# EAGLE schematic Control_Board (EAGLE 7.5.0)
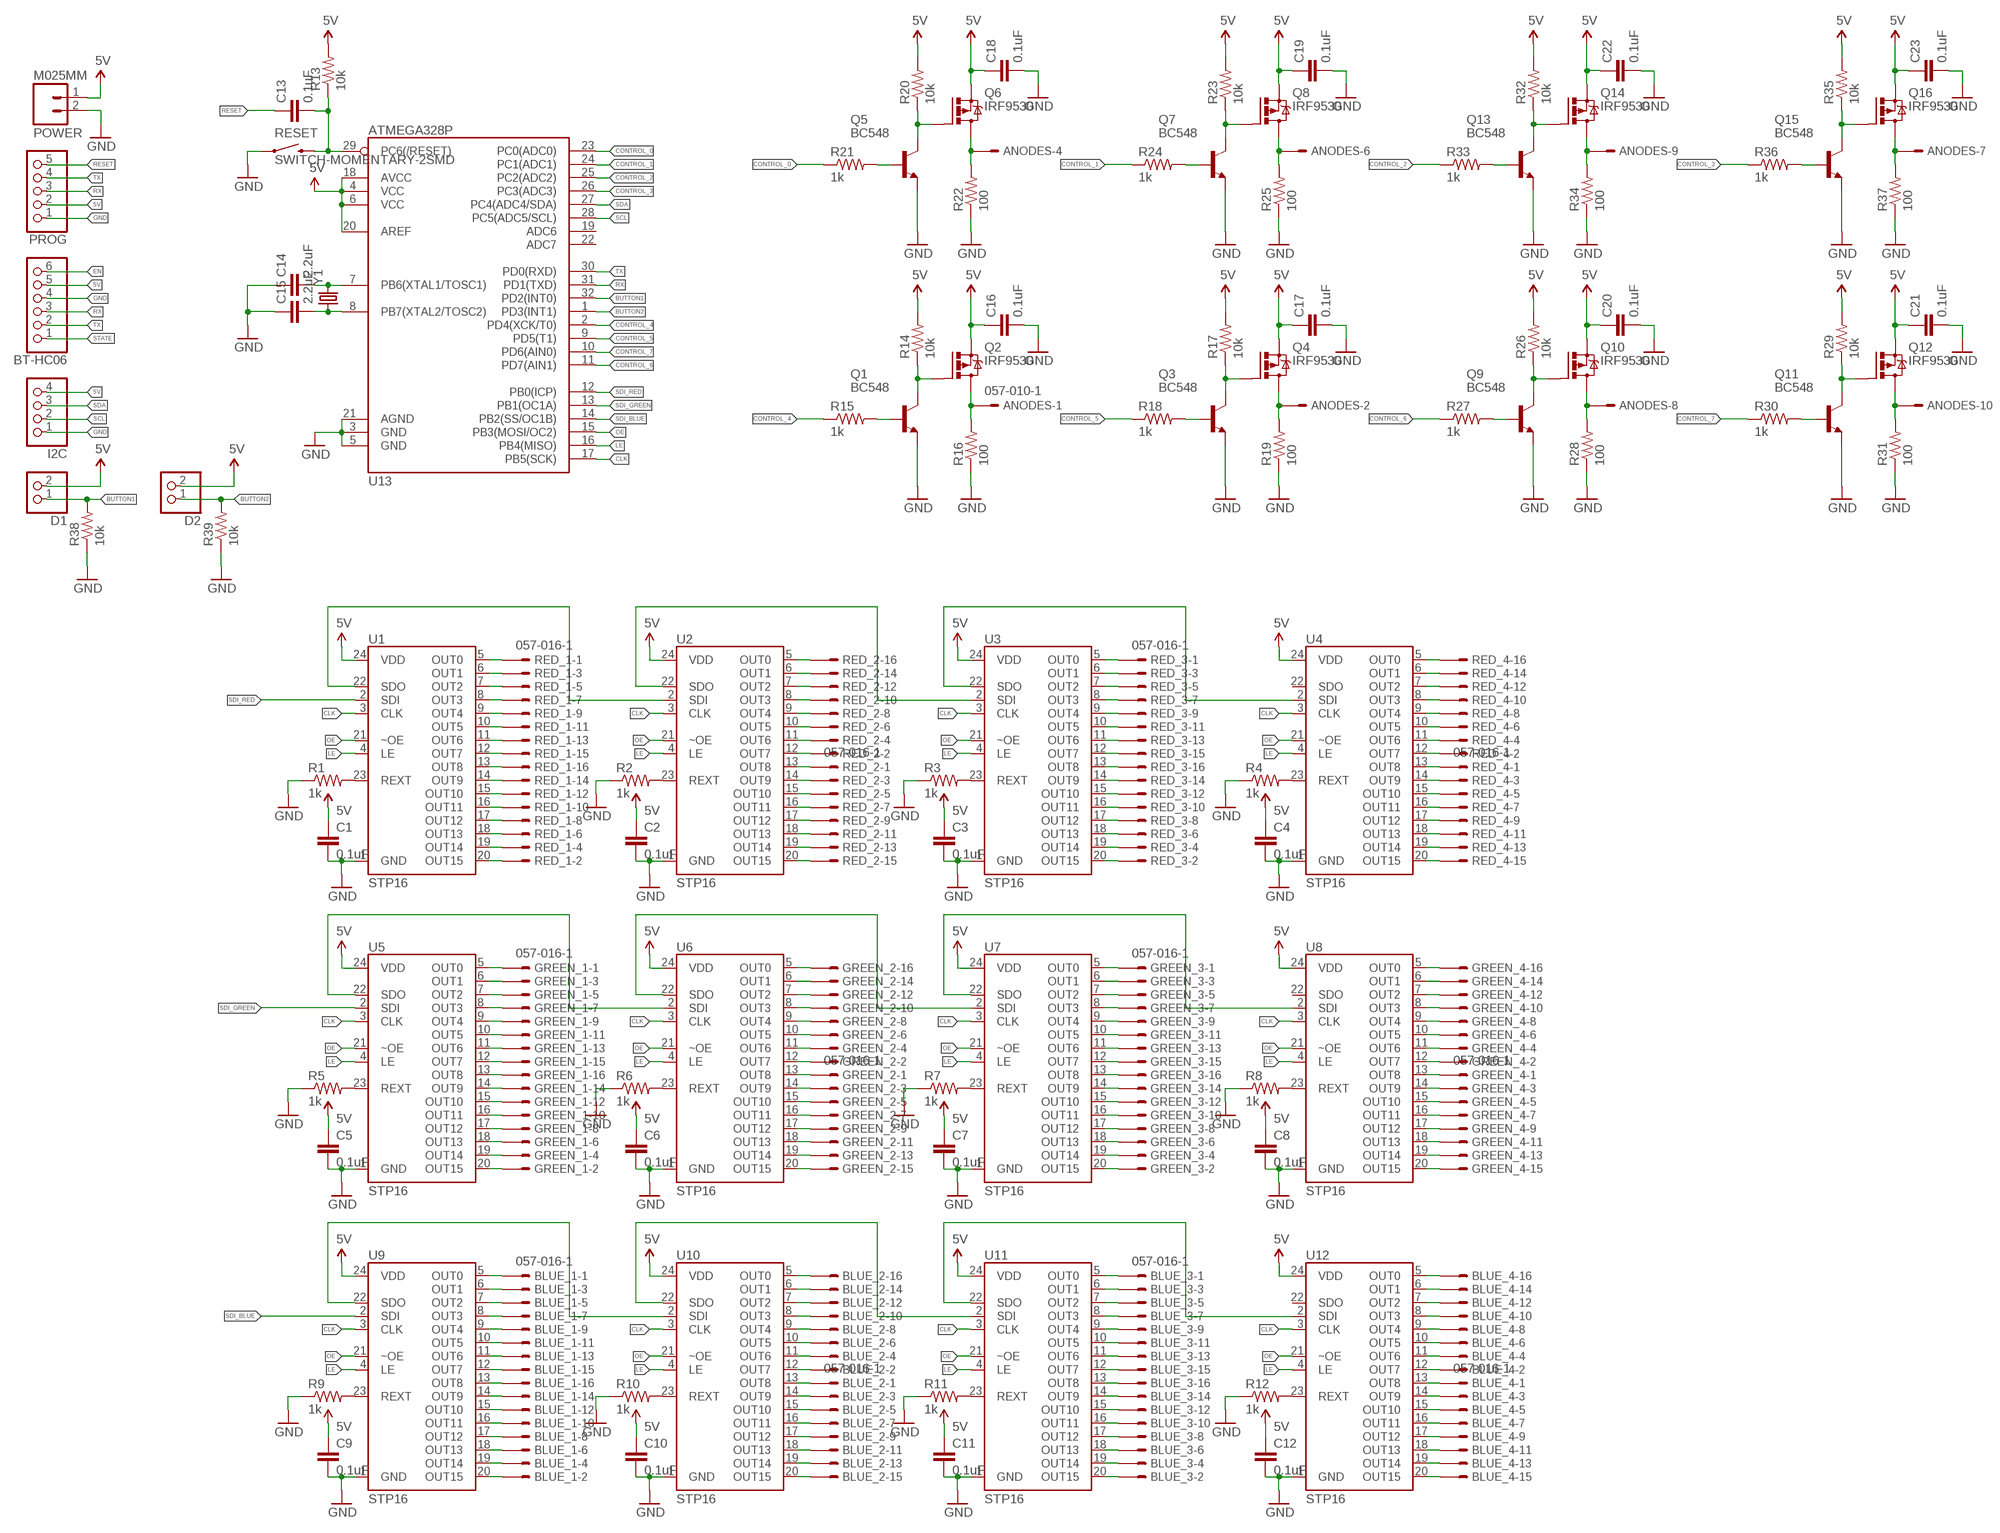
[diagram p0: schematic, sheet 1]

## Parts
ANODES  057-010-1  [057-010-1]
BLUE_1  057-016-1  [057-016-1]
BLUE_2  057-016-1  [057-016-1]
BLUE_3  057-016-1  [057-016-1]
BLUE_4  057-016-1  [057-016-1]
BT-HC06  PINHD-1X6/90  [1X06/90]
C1  0.1uF  0.1UF-100V-10%(0603)  [0603-CAP]
C2  0.1uF  0.1UF-100V-10%(0603)  [0603-CAP]
C3  0.1uF  0.1UF-100V-10%(0603)  [0603-CAP]
C4  0.1uF  0.1UF-100V-10%(0603)  [0603-CAP]
C5  0.1uF  0.1UF-100V-10%(0603)  [0603-CAP]
C6  0.1uF  0.1UF-100V-10%(0603)  [0603-CAP]
C7  0.1uF  0.1UF-100V-10%(0603)  [0603-CAP]
C8  0.1uF  0.1UF-100V-10%(0603)  [0603-CAP]
C9  0.1uF  0.1UF-100V-10%(0603)  [0603-CAP]
C10  0.1uF  0.1UF-100V-10%(0603)  [0603-CAP]
C11  0.1uF  0.1UF-100V-10%(0603)  [0603-CAP]
C12  0.1uF  0.1UF-100V-10%(0603)  [0603-CAP]
C13  0.1uF  0.1UF-100V-10%(0603)  [0603-CAP]
C14  2.2uF  2.2UF-10V-20%(0603)  [0603-CAP]
C15  2.2uF  2.2UF-10V-20%(0603)  [0603-CAP]
C16  0.1uF  0.1UF-100V-10%(0603)  [0603-CAP]
C17  0.1uF  0.1UF-100V-10%(0603)  [0603-CAP]
C18  0.1uF  0.1UF-100V-10%(0603)  [0603-CAP]
C19  0.1uF  0.1UF-100V-10%(0603)  [0603-CAP]
C20  0.1uF  0.1UF-100V-10%(0603)  [0603-CAP]
C21  0.1uF  0.1UF-100V-10%(0603)  [0603-CAP]
C22  0.1uF  0.1UF-100V-10%(0603)  [0603-CAP]
C23  0.1uF  0.1UF-100V-10%(0603)  [0603-CAP]
D1  PINHD-1X2/90  [1X02/90]
D2  PINHD-1X2/90  [1X02/90]
GREEN_1  057-016-1  [057-016-1]
GREEN_2  057-016-1  [057-016-1]
GREEN_3  057-016-1  [057-016-1]
GREEN_4  057-016-1  [057-016-1]
I2C  PINHD-1X4/90  [1X04/90]
POWER  M025MM  [SCREWTERMINAL-5MM-2]
PROG  PINHD-1X5/90  [1X05/90]
Q1  BC548  [TO92-EBC]
Q2  IRF9530  [TO220BV]
Q3  BC548  [TO92-EBC]
Q4  IRF9530  [TO220BV]
Q5  BC548  [TO92-EBC]
Q6  IRF9530  [TO220BV]
Q7  BC548  [TO92-EBC]
Q8  IRF9530  [TO220BV]
Q9  BC548  [TO92-EBC]
Q10  IRF9530  [TO220BV]
Q11  BC548  [TO92-EBC]
Q12  IRF9530  [TO220BV]
Q13  BC548  [TO92-EBC]
Q14  IRF9530  [TO220BV]
Q15  BC548  [TO92-EBC]
Q16  IRF9530  [TO220BV]
R1  1k  1K-1%  [0603-RES]
R2  1k  1K-1%  [0603-RES]
R3  1k  1K-1%  [0603-RES]
R4  1k  1K-1%  [0603-RES]
R5  1k  1K-1%  [0603-RES]
R6  1k  1K-1%  [0603-RES]
R7  1k  1K-1%  [0603-RES]
R8  1k  1K-1%  [0603-RES]
R9  1k  1K-1%  [0603-RES]
R10  1k  1K-1%  [0603-RES]
R11  1k  1K-1%  [0603-RES]
R12  1k  1K-1%  [0603-RES]
R13  10k  10K-1%RES-00824  [0603-RES]
R14  10k  10K-1%RES-00824  [0603-RES]
R15  1k  1K-1%  [0603-RES]
R16  100  100OHM1/10W1%(0603)  [0603-RES]
R17  10k  10K-1%RES-00824  [0603-RES]
R18  1k  1K-1%  [0603-RES]
R19  100  100OHM1/10W1%(0603)  [0603-RES]
R20  10k  10K-1%RES-00824  [0603-RES]
R21  1k  1K-1%  [0603-RES]
R22  100  100OHM1/10W1%(0603)  [0603-RES]
R23  10k  10K-1%RES-00824  [0603-RES]
R24  1k  1K-1%  [0603-RES]
R25  100  100OHM1/10W1%(0603)  [0603-RES]
R26  10k  10K-1%RES-00824  [0603-RES]
R27  1k  1K-1%  [0603-RES]
R28  100  100OHM1/10W1%(0603)  [0603-RES]
R29  10k  10K-1%RES-00824  [0603-RES]
R30  1k  1K-1%  [0603-RES]
R31  100  100OHM1/10W1%(0603)  [0603-RES]
R32  10k  10K-1%RES-00824  [0603-RES]
R33  1k  1K-1%  [0603-RES]
R34  100  100OHM1/10W1%(0603)  [0603-RES]
R35  10k  10K-1%RES-00824  [0603-RES]
R36  1k  1K-1%  [0603-RES]
R37  100  100OHM1/10W1%(0603)  [0603-RES]
R38  10k  10K-1%RES-00824  [0603-RES]
R39  10k  10K-1%RES-00824  [0603-RES]
RED_1  057-016-1  [057-016-1]
RED_2  057-016-1  [057-016-1]
RED_3  057-016-1  [057-016-1]
RED_4  057-016-1  [057-016-1]
RESET  SWITCH-MOMENTARY-2SMD  [TACTILE_SWITCH_SMD]
U1  STP16  [TSSOP-24]
U2  STP16  [TSSOP-24]
U3  STP16  [TSSOP-24]
U4  STP16  [TSSOP-24]
U5  STP16  [TSSOP-24]
U6  STP16  [TSSOP-24]
U7  STP16  [TSSOP-24]
U8  STP16  [TSSOP-24]
U9  STP16  [TSSOP-24]
U10  STP16  [TSSOP-24]
U11  STP16  [TSSOP-24]
U12  STP16  [TSSOP-24]
U13  ATMEGA328P  ATMEGA328_SMT  [TQFP32-08]
Y1  CRYSTALHC49UV  [HC49U-V]

## Nets
5V: BT-HC06.5 C1.1 C2.1 C3.1 C4.1 C5.1 C6.1 C7.1 C8.1 C9.1 C10.1 C11.1 C12.1 C16.1 C17.1 C18.1 C19.1 C20.1 C21.1 C22.1 C23.1 D1.2 D2.2 I2C.4 POWER.1 PROG.2 Q2.S Q4.S Q6.S Q8.S Q10.S Q12.S Q14.S Q16.S R13.2 R14.2 R17.2 R20.2 R23.2 R26.2 R29.2 R32.2 R35.2 U1.24(VDD) U2.24(VDD) U3.24(VDD) U4.24(VDD) U5.24(VDD) U6.24(VDD) U7.24(VDD) U8.24(VDD) U9.24(VDD) U10.24(VDD) U11.24(VDD) U12.24(VDD) U13.6(VCC) U13.18(AVCC) U13.20(AREF)
BUTTON1: D1.1 R38.2 U13.32(PD2(INT0))
BUTTON2: D2.1 R39.2 U13.1(PD3(INT1))
CLK: U1.3(CLK) U2.3(CLK) U3.3(CLK) U4.3(CLK) U5.3(CLK) U6.3(CLK) U7.3(CLK) U8.3(CLK) U9.3(CLK) U10.3(CLK) U11.3(CLK) U12.3(CLK) U13.17(PB5(SCK))
CONTROL_0: R21.1 U13.23(PC0(ADC0))
CONTROL_1: R24.1 U13.24(PC1(ADC1))
CONTROL_2: R33.1 U13.25(PC2(ADC2))
CONTROL_3: R36.1 U13.26(PC3(ADC3))
CONTROL_4: R15.1 U13.2(PD4(XCK/T0))
CONTROL_5: R18.1 U13.9(PD5(T1))
CONTROL_6: R27.1 U13.11(PD7(AIN1))
CONTROL_7: R30.1 U13.10(PD6(AIN0))
EN: BT-HC06.6
GND: BT-HC06.4 C1.2 C2.2 C3.2 C4.2 C5.2 C6.2 C7.2 C8.2 C9.2 C10.2 C11.2 C12.2 C14.1 C15.1 C16.2 C17.2 C18.2 C19.2 C20.2 C21.2 C22.2 C23.2 I2C.1 POWER.2 PROG.1 Q1.E Q3.E Q5.E Q7.E Q9.E Q11.E Q13.E Q15.E R1.1 R2.1 R3.1 R4.1 R5.1 R6.1 R7.1 R8.1 R9.1 R10.1 R11.1 R12.1 R16.1 R19.1 R22.1 R25.1 R28.1 R31.1 R34.1 R37.1 R38.1 R39.1 RESET.1 U1.1(GND) U2.1(GND) U3.1(GND) U4.1(GND) U5.1(GND) U6.1(GND) U7.1(GND) U8.1(GND) U9.1(GND) U10.1(GND) U11.1(GND) U12.1(GND) U13.5(GND) U13.21(AGND)
LE: U1.4(LE) U2.4(LE) U3.4(LE) U4.4(LE) U5.4(LE) U6.4(LE) U7.4(LE) U8.4(LE) U9.4(LE) U10.4(LE) U11.4(LE) U12.4(LE) U13.16(PB4(MISO))
LEVEL_0: ANODES.4 Q6.D R22.2
LEVEL_1: ANODES.6 Q8.D R25.2
LEVEL_2: ANODES.9 Q14.D R34.2
LEVEL_3: ANODES.7 Q16.D R37.2
LEVEL_4: ANODES.1 Q2.D R16.2
LEVEL_5: ANODES.2 Q4.D R19.2
LEVEL_6: ANODES.8 Q10.D R28.2
LEVEL_7: ANODES.10 Q12.D R31.2
N$1: R1.2 U1.23(REXT)
N$2: RED_1.16 U1.13(OUT8)
N$3: RED_1.14 U1.14(OUT9)
N$4: RED_1.12 U1.15(OUT10)
N$5: RED_1.10 U1.16(OUT11)
N$6: RED_1.8 U1.17(OUT12)
N$7: RED_1.6 U1.18(OUT13)
N$8: RED_1.4 U1.19(OUT14)
N$9: RED_1.2 U1.20(OUT15)
N$10: RED_1.15 U1.12(OUT7)
N$11: RED_1.13 U1.11(OUT6)
N$12: RED_1.11 U1.10(OUT5)
N$13: RED_1.9 U1.9(OUT4)
N$14: RED_1.7 U1.8(OUT3)
N$15: RED_1.5 U1.7(OUT2)
N$16: RED_1.3 U1.6(OUT1)
N$17: RED_1.1 U1.5(OUT0)
N$18: R2.2 U2.23(REXT)
N$19: RED_2.2 U2.12(OUT7)
N$20: RED_2.4 U2.11(OUT6)
N$21: RED_2.6 U2.10(OUT5)
N$22: RED_2.8 U2.9(OUT4)
N$23: RED_2.10 U2.8(OUT3)
N$24: RED_2.12 U2.7(OUT2)
N$25: RED_2.14 U2.6(OUT1)
N$26: RED_2.16 U2.5(OUT0)
N$27: RED_2.1 U2.13(OUT8)
N$28: RED_2.3 U2.14(OUT9)
N$29: RED_2.5 U2.15(OUT10)
N$30: RED_2.7 U2.16(OUT11)
N$31: RED_2.9 U2.17(OUT12)
N$32: RED_2.11 U2.18(OUT13)
N$33: RED_2.13 U2.19(OUT14)
N$34: RED_2.15 U2.20(OUT15)
N$35: R3.2 U3.23(REXT)
N$36: RED_3.1 U3.5(OUT0)
N$37: RED_3.2 U3.20(OUT15)
N$38: RED_3.3 U3.6(OUT1)
N$39: RED_3.4 U3.19(OUT14)
N$40: RED_3.5 U3.7(OUT2)
N$41: RED_3.6 U3.18(OUT13)
N$42: RED_3.7 U3.8(OUT3)
N$43: RED_3.8 U3.17(OUT12)
N$44: RED_3.9 U3.9(OUT4)
N$45: RED_3.10 U3.16(OUT11)
N$46: RED_3.11 U3.10(OUT5)
N$47: RED_3.12 U3.15(OUT10)
N$48: RED_3.13 U3.11(OUT6)
N$49: RED_3.14 U3.14(OUT9)
N$50: RED_3.15 U3.12(OUT7)
N$51: RED_3.16 U3.13(OUT8)
N$52: R4.2 U4.23(REXT)
N$53: RED_4.1 U4.13(OUT8)
N$54: RED_4.2 U4.12(OUT7)
N$55: RED_4.3 U4.14(OUT9)
N$56: RED_4.4 U4.11(OUT6)
N$57: RED_4.5 U4.15(OUT10)
N$58: RED_4.6 U4.10(OUT5)
N$59: RED_4.7 U4.16(OUT11)
N$60: RED_4.8 U4.9(OUT4)
N$61: RED_4.9 U4.17(OUT12)
N$62: RED_4.10 U4.8(OUT3)
N$63: RED_4.11 U4.18(OUT13)
N$64: RED_4.12 U4.7(OUT2)
N$65: RED_4.13 U4.19(OUT14)
N$66: RED_4.14 U4.6(OUT1)
N$67: RED_4.15 U4.20(OUT15)
N$68: RED_4.16 U4.5(OUT0)
N$69: U1.22(SDO) U2.2(SDI)
N$70: U2.22(SDO) U3.2(SDI)
N$71: U3.22(SDO) U4.2(SDI)
N$72: R5.2 U5.23(REXT)
N$73: R6.2 U6.23(REXT)
N$74: R7.2 U7.23(REXT)
N$75: R8.2 U8.23(REXT)
N$76: U5.22(SDO) U6.2(SDI)
N$77: U6.22(SDO) U7.2(SDI)
N$78: U7.22(SDO) U8.2(SDI)
N$79: GREEN_1.16 U5.13(OUT8)
N$80: GREEN_1.14 U5.14(OUT9)
N$81: GREEN_1.12 U5.15(OUT10)
N$82: GREEN_1.10 U5.16(OUT11)
N$83: GREEN_1.8 U5.17(OUT12)
N$84: GREEN_1.6 U5.18(OUT13)
N$85: GREEN_1.4 U5.19(OUT14)
N$86: GREEN_1.2 U5.20(OUT15)
N$87: GREEN_1.15 U5.12(OUT7)
N$88: GREEN_1.13 U5.11(OUT6)
N$89: GREEN_1.11 U5.10(OUT5)
N$90: GREEN_1.9 U5.9(OUT4)
N$91: GREEN_1.7 U5.8(OUT3)
N$92: GREEN_1.5 U5.7(OUT2)
N$93: GREEN_1.3 U5.6(OUT1)
N$94: GREEN_1.1 U5.5(OUT0)
N$95: GREEN_3.1 U7.5(OUT0)
N$96: GREEN_3.2 U7.20(OUT15)
N$97: GREEN_3.3 U7.6(OUT1)
N$98: GREEN_3.4 U7.19(OUT14)
N$99: GREEN_3.5 U7.7(OUT2)
N$100: GREEN_3.6 U7.18(OUT13)
N$101: GREEN_3.7 U7.8(OUT3)
N$102: GREEN_3.8 U7.17(OUT12)
N$103: GREEN_3.9 U7.9(OUT4)
N$104: GREEN_3.10 U7.16(OUT11)
N$105: GREEN_3.11 U7.10(OUT5)
N$106: GREEN_3.12 U7.15(OUT10)
N$107: GREEN_3.13 U7.11(OUT6)
N$108: GREEN_3.14 U7.14(OUT9)
N$109: GREEN_3.15 U7.12(OUT7)
N$110: GREEN_3.16 U7.13(OUT8)
N$111: GREEN_2.2 U6.12(OUT7)
N$112: GREEN_2.4 U6.11(OUT6)
N$113: GREEN_2.6 U6.10(OUT5)
N$114: GREEN_2.8 U6.9(OUT4)
N$115: GREEN_2.10 U6.8(OUT3)
N$116: GREEN_2.12 U6.7(OUT2)
N$117: GREEN_2.14 U6.6(OUT1)
N$118: GREEN_2.16 U6.5(OUT0)
N$119: GREEN_2.1 U6.13(OUT8)
N$120: GREEN_2.3 U6.14(OUT9)
N$121: GREEN_2.5 U6.15(OUT10)
N$122: GREEN_2.7 U6.16(OUT11)
N$123: GREEN_2.9 U6.17(OUT12)
N$124: GREEN_2.11 U6.18(OUT13)
N$125: GREEN_2.13 U6.19(OUT14)
N$126: GREEN_2.15 U6.20(OUT15)
N$127: GREEN_4.1 U8.13(OUT8)
N$128: GREEN_4.2 U8.12(OUT7)
N$129: GREEN_4.3 U8.14(OUT9)
N$130: GREEN_4.4 U8.11(OUT6)
N$131: GREEN_4.5 U8.15(OUT10)
N$132: GREEN_4.6 U8.10(OUT5)
N$133: GREEN_4.7 U8.16(OUT11)
N$134: GREEN_4.8 U8.9(OUT4)
N$135: GREEN_4.9 U8.17(OUT12)
N$136: GREEN_4.10 U8.8(OUT3)
N$137: GREEN_4.11 U8.18(OUT13)
N$138: GREEN_4.12 U8.7(OUT2)
N$139: GREEN_4.13 U8.19(OUT14)
N$140: GREEN_4.14 U8.6(OUT1)
N$141: GREEN_4.15 U8.20(OUT15)
N$142: GREEN_4.16 U8.5(OUT0)
N$143: R9.2 U9.23(REXT)
N$144: R10.2 U10.23(REXT)
N$145: R11.2 U11.23(REXT)
N$146: R12.2 U12.23(REXT)
N$147: U9.22(SDO) U10.2(SDI)
N$148: U10.22(SDO) U11.2(SDI)
N$149: U11.22(SDO) U12.2(SDI)
N$150: BLUE_1.16 U9.13(OUT8)
N$151: BLUE_1.14 U9.14(OUT9)
N$152: BLUE_1.12 U9.15(OUT10)
N$153: BLUE_1.10 U9.16(OUT11)
N$154: BLUE_1.8 U9.17(OUT12)
N$155: BLUE_1.6 U9.18(OUT13)
N$156: BLUE_1.4 U9.19(OUT14)
N$157: BLUE_1.2 U9.20(OUT15)
N$158: BLUE_1.15 U9.12(OUT7)
N$159: BLUE_1.13 U9.11(OUT6)
N$160: BLUE_1.11 U9.10(OUT5)
N$161: BLUE_1.9 U9.9(OUT4)
N$162: BLUE_1.7 U9.8(OUT3)
N$163: BLUE_1.5 U9.7(OUT2)
N$164: BLUE_1.3 U9.6(OUT1)
N$165: BLUE_1.1 U9.5(OUT0)
N$166: BLUE_3.1 U11.5(OUT0)
N$167: BLUE_3.2 U11.20(OUT15)
N$168: BLUE_3.3 U11.6(OUT1)
N$169: BLUE_3.4 U11.19(OUT14)
N$170: BLUE_3.5 U11.7(OUT2)
N$171: BLUE_3.6 U11.18(OUT13)
N$172: BLUE_3.7 U11.8(OUT3)
N$173: BLUE_3.8 U11.17(OUT12)
N$174: BLUE_3.9 U11.9(OUT4)
N$175: BLUE_3.10 U11.16(OUT11)
N$176: BLUE_3.11 U11.10(OUT5)
N$177: BLUE_3.12 U11.15(OUT10)
N$178: BLUE_3.13 U11.11(OUT6)
N$179: BLUE_3.14 U11.14(OUT9)
N$180: BLUE_3.15 U11.12(OUT7)
N$181: BLUE_3.16 U11.13(OUT8)
N$182: BLUE_2.2 U10.12(OUT7)
N$183: BLUE_2.4 U10.11(OUT6)
N$184: BLUE_2.6 U10.10(OUT5)
N$185: BLUE_2.8 U10.9(OUT4)
N$186: BLUE_2.10 U10.8(OUT3)
N$187: BLUE_2.12 U10.7(OUT2)
N$188: BLUE_2.14 U10.6(OUT1)
N$189: BLUE_2.16 U10.5(OUT0)
N$190: BLUE_2.1 U10.13(OUT8)
N$191: BLUE_2.3 U10.14(OUT9)
N$192: BLUE_2.5 U10.15(OUT10)
N$193: BLUE_2.7 U10.16(OUT11)
N$194: BLUE_2.9 U10.17(OUT12)
N$195: BLUE_2.11 U10.18(OUT13)
N$196: BLUE_2.13 U10.19(OUT14)
N$197: BLUE_2.15 U10.20(OUT15)
N$198: BLUE_4.1 U12.13(OUT8)
N$199: BLUE_4.2 U12.12(OUT7)
N$200: BLUE_4.3 U12.14(OUT9)
N$201: BLUE_4.4 U12.11(OUT6)
N$202: BLUE_4.5 U12.15(OUT10)
N$203: BLUE_4.6 U12.10(OUT5)
N$204: BLUE_4.7 U12.16(OUT11)
N$205: BLUE_4.8 U12.9(OUT4)
N$206: BLUE_4.9 U12.17(OUT12)
N$207: BLUE_4.10 U12.8(OUT3)
N$208: BLUE_4.11 U12.18(OUT13)
N$209: BLUE_4.12 U12.7(OUT2)
N$210: BLUE_4.13 U12.19(OUT14)
N$211: BLUE_4.14 U12.6(OUT1)
N$212: BLUE_4.15 U12.20(OUT15)
N$213: BLUE_4.16 U12.5(OUT0)
N$214: C13.2 R13.1 RESET.3 U13.29(PC6(/RESET))
N$215: Q1.C Q2.G R14.1
N$216: C14.2 U13.7(PB6(XTAL1/TOSC1)) Y1.2
N$217: C15.2 U13.8(PB7(XTAL2/TOSC2)) Y1.1
N$218: Q1.B R15.2
N$219: Q3.C Q4.G R17.1
N$220: Q3.B R18.2
N$221: Q5.C Q6.G R20.1
N$222: Q5.B R21.2
N$223: Q7.C Q8.G R23.1
N$224: Q7.B R24.2
N$225: Q9.C Q10.G R26.1
N$226: Q9.B R27.2
N$227: Q11.C Q12.G R29.1
N$228: Q11.B R30.2
N$229: Q13.C Q14.G R32.1
N$230: Q13.B R33.2
N$231: Q15.C Q16.G R35.1
N$232: Q15.B R36.2
OE: U1.21(~OE) U2.21(~OE) U3.21(~OE) U4.21(~OE) U5.21(~OE) U6.21(~OE) U7.21(~OE) U8.21(~OE) U9.21(~OE) U10.21(~OE) U11.21(~OE) U12.21(~OE) U13.15(PB3(MOSI/OC2))
RESET: C13.1 PROG.5
RX: BT-HC06.3 PROG.3 U13.31(PD1(TXD))
SCL: I2C.2 U13.28(PC5(ADC5/SCL))
SDA: I2C.3 U13.27(PC4(ADC4/SDA))
SDI_BLUE: U9.2(SDI) U13.14(PB2(SS/OC1B))
SDI_GREEN: U5.2(SDI) U13.13(PB1(OC1A))
SDI_RED: U1.2(SDI) U13.12(PB0(ICP))
STATE: BT-HC06.1
TX: BT-HC06.2 PROG.4 U13.30(PD0(RXD))
Unconnected: ANODES.3 ANODES.5 U4.22(SDO) U8.22(SDO) U12.22(SDO) U13.3(GND) U13.4(VCC) U13.19(ADC6) U13.22(ADC7)

## Library data of the parts
ANODES = con-panduit:057-010-: CONNECTOR 10-pin series 057 contact pc board low profile headers; OC_FARNELL: unknown; OC_NEWARK: unknown
BLUE_1-BLUE_4 GREEN_1-GREEN_4 RED_1-RED_4 = con-panduit:057-016-: CONNECTOR 10-pin series 057 contact pc board low profile headers; OC_FARNELL: unknown; OC_NEWARK: unknown
BT-HC06 = pinhead:PINHD-1X6: PIN HEADER
C1-C13 C16-C23 = SparkFun-Capacitors:0.1UF-100V-10%(0603): CAP-08390; PROD_ID: CAP-08390
C14 C15 = SparkFun-Capacitors:2.2UF-10V-20%(0603): CAP-07888; PROD_ID: CAP-07888
D1 D2 = pinhead:PINHD-1X2: PIN HEADER
I2C = pinhead:PINHD-1X4: PIN HEADER
POWER = SparkFun-Connectors:M02: Standard 2-pin 0.1" header. Use with - straight break away headers ( PRT-00116) - right angle break away headers (PRT-00553) - swiss pins (PRT-00743) - machine pins (PRT-00117) - female headers (PRT-00115) Molex polarized connector foot print use with: PRT-08233 with associated crimp pins and housings. 2.54_SCREWTERM for use with PRT-10571. 3.5mm Screw Terminal footprints for PRT-08084 5mm Screw Terminal footprints for use with PRT-08433
PROG = pinhead:PINHD-1X5: PIN HEADER
Q1 Q3 Q5 Q7 Q9 Q11 Q13 Q15 = transistor-npn:BC548*: NPN Transistor
Q2 Q4 Q6 Q8 Q10 Q12 Q14 Q16 = transistor-power:IRF9530: P-CHANNEL HEXFET POWER-MOS-FET Source: http://www.irf.com/product-info/datasheets/data/irf9530.pdf
R1-R12 R15 R18 R21 R24 R27 R30 R33 R36 = SparkFun-Resistors:1K-1%: 1k-ohm SMT 1/10W - 1% (0603) RES-07856; PROD_ID: RES-07856
R13 R14 R17 R20 R23 R26 R29 R32 R35 R38 R39 = SparkFun-Resistors:10K-1%: 10k-ohm SMT 1/10W - 1% (0603) RES-00824; PROD_ID: RES-00824
R16 R19 R22 R25 R28 R31 R34 R37 = SparkFun-Resistors:100OHM1/10W1%(0603): RES-07863; PROD_ID: RES-07863
RESET = SparkFun-Electromechanical:SWITCH-MOMENTARY-2: Various NO switches- pushbuttons, reed, etc
U1-U12 = STP16:STP16
U13 = SparkFun-DigitalIC:ATMEGA328_SMT: 32-Pin Atmega328 part Commonly used on Arduino compatible boards Available in QFP and QFN packages TQFP is IC-09069 QFN is non-stock; PROD_ID: IC-09069
Y1 = SparkFun-FreqCtrl:CRYSTAL: Various standard crystals. Proven footprints. Spark Fun Electronics SKU : COM-00534